# Altium schematic sheet Refreshmate_Air_freshner_&_fan_module.SchDoc
size A4 portrait; SheetNumber: 1; SheetTotal: 1
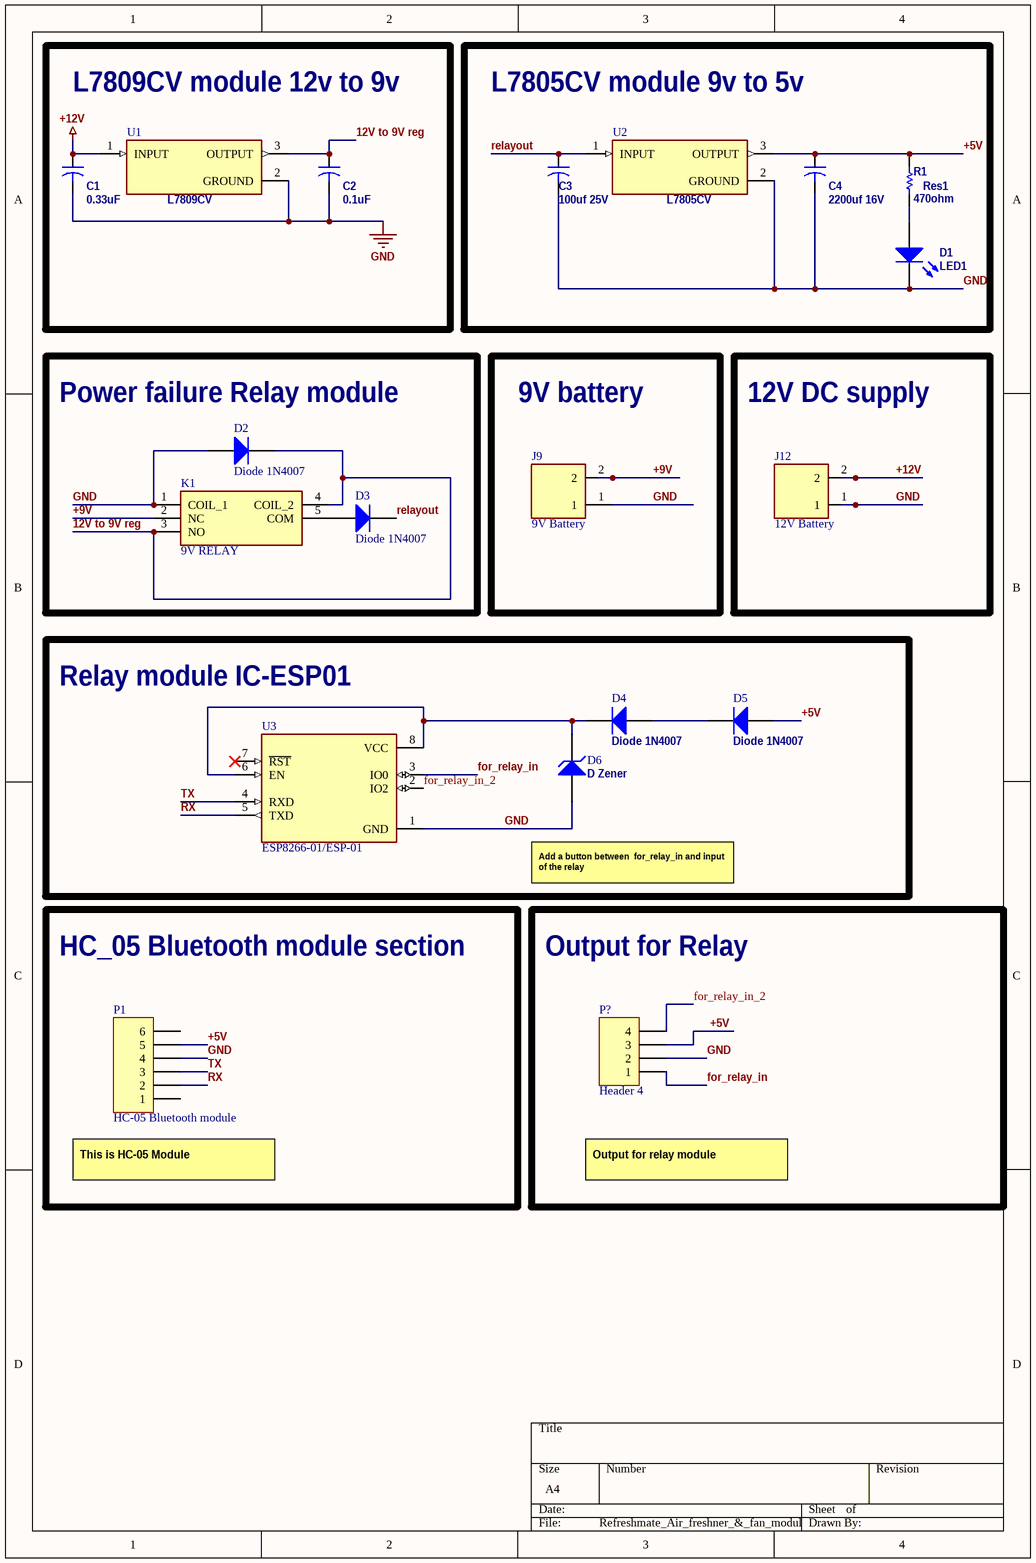
[diagram p0: Refreshmate_Air_freshner_&_fan_module.SchDoc]

## Parts
C1  0.33uF  [CAPR5-4X5]
C2  0.1uF  [CAPR5-4X5]
C3  100uf 25V  [CAPR5-4X5]
C4  2200uf 16V  [CAPR5-4X5]
D1  LED1  [LED-1]
D2  Diode 1N4007  [DO-41]
D3  Diode 1N4007  [DO-41]
D4  Diode 1N4007  [DO-41]
D5  Diode 1N4007  [DO-41]
D6  D Zener  [DIODE-0.7]
J9  9V Battery  [HANDSON_KF301-2P]
J12  12V Battery  [HANDSON_KF301-2P]
K1  9V RELAY  [JQC3FT731Z12VDC]
P1  HC-05 Bluetooth module  [HDR1X6]
P?  Header 4  [HDR1X4]
R1  Res1  value 470ohm  [AXIAL-0.3]
U1  L7809CV  [TO255P1040X460X1968-3]
U2  L7805CV  [TO255P1040X460X1968-3]
U3  ESP8266-01/ESP-01  [XCVR_ESP8266-01/ESP-01]

## Blocks framed on the sheet
L7809CV module 12v to 9v: C1 C2 U1
L7805CV module 9v to 5v: C3 C4 D1 R1 U2
Power failure Relay module: D2 D3 K1
9V battery: J9
12V DC supply: J12
Relay module IC-ESP01: D4-D6 U3
HC_05 Bluetooth module section: P1
Output for Relay: P?

## Nets
+12V: C1.1 J12.2 U1.1(INPUT)
GND: C1.2 C2.2 C3.2 C4.2 D1.2(K) D2.1(A) D6.1(A) J9.1 J12.1 K1.1(COIL_1) P1.4 P?.2 U1.2(GROUND) U2.2(GROUND) U3.1(GND)
12V to 9V reg: C2.1 D2.2(K) K1.3(NO) K1.4(COIL_2) U1.3(OUTPUT)
+5V: C4.1 D5.1(A) P1.5 P?.3 R1.2 U2.3(OUTPUT)
+9V: J9.2 K1.2(NC)
for_relay_in: P?.1 U3.3(IO0)
for_relay_in_2: P?.4 U3.2(IO2)
relayout: C3.1 D3.2(K) U2.1(INPUT)
RX: P1.2 U3.5(TXD)
TX: P1.3 U3.4(RXD)
NetD1_1: D1.1(A) R1.1
NetD3_1: D3.1(A) K1.5(COM)
NetD4_1: D4.1(A) D5.2(K)
NetD4_2: D4.2(K) D6.2(K) U3.6(EN) U3.8(VCC)

Not connected (* = marked no-connect by the designer): P1 1 6; U3 7(~{RST})*

## Notes on the sheet
- Add a button between  for_relay_in and input of the relay
- (near P1) This is HC-05 Module
- Output for relay module

## Library data of the parts
C1-C4 = Cap2: Capacitor; Published: 23-Sep-2002; PackageReference: CAPR5-4X5; Publisher: Altium Limited; PackageDescription: Capacitor; 2 Leads
D1 = LED1: Typical RED GaAs LED; Published: 8-Jun-2000; LatestRevisionDate: 08-Jul-2005; LatestRevisionNote: Mech Layer 1 removed.; PackageReference: LED-1; Publisher: Altium Limited; PackageDescription: LED; 2 Leads
D2-D5 = Diode 1N4007: 1 Amp General Purpose Rectifier; Published: 8-Jun-2000; LatestRevisionDate: 17-Jul-2002; LatestRevisionNote: Re-released for DXP Platform.; DatasheetVersion: 1998; PackageVersion: Aug-1999; PackageReference: DO-41; Publisher: Altium Limited; PackageDescription: Diode, Axial; Body 5.2 x 2.7 mm (LxDia. max), Lead Dia. 0.86 mm (max); Code_JEDEC: DO-204-AL; ComponentLink1Description: Manufacturer Link; ComponentLink1URL: http://www.fairchildsemi.com/; ComponentLink2Description: Datasheet; ComponentLink2URL: http://www.fairchildsemi.com/ds/1N%2F1N4001.pdf
D6 = D Zener: Zener Diode; Published: 8-Jun-2000; LatestRevisionDate: 17-Jul-2002; LatestRevisionNote: Re-released for DXP Platform.; PackageReference: DIODE-0.7; Publisher: Altium Limited; PackageDescription: Diode, Thru-Hole; 2 Leads; 0.7 in Pin Spacing
J9 J12 = KF301-2P: 2 Pin Terminal Block 5mm Pitch; Price: None; Value: *; MP: KF301-2P; Package: None; Availability: Unavailable
K1 = JQC-3F-_T73_-1Z-12VDC: RELAY POWER 10A 12VDC 1C PCB TYPE (JS1) 5PIN QIANJ; Manufacturer_Name: QIANJI; Manufacturer_Part_Number: JQC-3F-(T73)-1Z-12VDC; Geometry.Height: 15.5mm; Mouser Part Number: *; Mouser Price/Stock: *; Arrow Part Number: *; Arrow Price/Stock: *; Datasheet Link: https://img.ozdisan.com/ETicaret_Dosya/341245_8627675.pdf
P1 = Header 6: Header, 6-Pin; LatestRevisionDate: 17-Jul-2002; LatestRevisionNote: Re-released for DXP Platform.; Publisher: Altium Limited
P? = Header 4: Header, 4-Pin; LatestRevisionDate: 17-Jul-2002; LatestRevisionNote: Re-released for DXP Platform.; Publisher: Altium Limited
R1 = Res1: Resistor; Published: 8-Jun-2000; LatestRevisionDate: 17-Jul-2002; LatestRevisionNote: Re-released for DXP Platform.; PackageReference: AXIAL-0.3; Publisher: Altium Limited; PackageDescription: Axial Device, Thru-Hole; 2 Leads; 0.3 in Pin Spacing
U1 U2 = L7805CV: Linear Voltage Regulator IC Positive Fixed 1 Output 1.5A TO-220; MF: STMicroelectronics; SnapEDA_Link: https://www.snapeda.com/parts/L7805CV/STMicroelectronics/view-part/?ref=snap; Package: TO-220-3 ON Semiconductor; MP: L7805CV; Check_prices: https://www.snapeda.com/parts/L7805CV/STMicroelectronics/view-part/?ref=eda; Purchase-URL: https://pricing.snapeda.com/search/part/L7805CV/?ref=eda; Price: None; Value: *; Availability: In Stock
U3 = ESP8266-01/ESP-01: MakerFocus 4pcs ESP8266 ESP-01 Serial Wireless WiFi Transceiver Receiver Module 1MB SPI Flash DC3.0-3.6V Internet of Things WiFi Module Board Compatible with Ar duino; Value: *; MP: ESP8266-01/ESP-01; Package: None; Availability: Unavailable; Price: None